# EAGLE schematic SelfTestWiring (EAGLE 7.6.0)
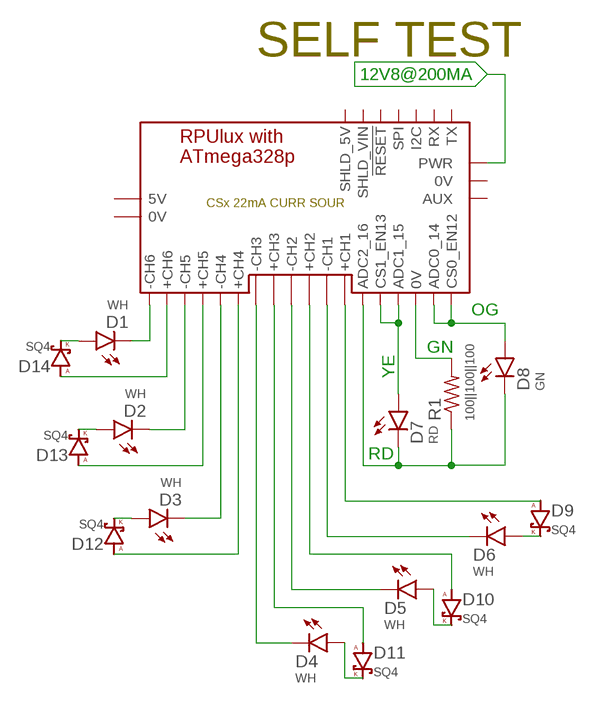
[diagram p0: schematic, sheet 1]

## Parts
D1  WH  LED5MM  [LED5MM]
D2  WH  LED5MM  [LED5MM]
D3  WH  LED5MM  [LED5MM]
D4  WH  LED5MM  [LED5MM]
D5  WH  LED5MM  [LED5MM]
D6  WH  LED5MM  [LED5MM]
D7  RD  LED5MM  [LED5MM]
D8  GN  LED5MM  [LED5MM]
D9  SQ4  DSMA  [SMA]
D10  SQ4  DSMA  [SMA]
D11  SQ4  DSMA  [SMA]
D12  SQ4  DSMA  [SMA]
D13  SQ4  DSMA  [SMA]
D14  SQ4  DSMA  [SMA]
R1  100||100||100  R0805  [C0805(2012)]
U$1  RPULUX  [WITH_RPU_NAMES]

## Nets
12V8@200MA: U$1.PWR
GN: R1.2 U$1.0V@DIO2(0V)
N$1: D1.K U$1.-CH6
N$2: D2.K U$1.-CH5
N$3: D3.K U$1.-CH4
N$4: D4.K U$1.-CH3
N$5: D5.K U$1.-CH2
N$6: D6.K U$1.-CH1
N$7: D14.A U$1.+CH6
N$8: D13.A U$1.+CH5
N$9: D12.A U$1.+CH4
N$10: D11.A U$1.+CH3
N$11: D10.A U$1.+CH2
N$12: D9.A U$1.+CH1
N$13: D6.A D9.K
N$14: D3.A D12.K
N$15: D2.A D13.K
N$16: D1.A D14.K
N$17: D5.A D10.K
N$18: D4.A D11.K
OG: D8.A U$1.22MA@ADC0(CS0_EN12) U$1.ADC0(ADC0_14)
RD: D7.K D8.K R1.1 U$1.ADC2(ADC2_16)
YE: D7.A U$1.22MA@ADC1(CS1_EN13) U$1.ADC1(ADC1_15)
Unconnected: U$1.0V U$1.0V@PWR(0V) U$1.5V U$1.!RESET U$1.AUX U$1.I2C U$1.RX U$1.SHLD_5V U$1.SHLD_VOUT(SHLD_VIN) U$1.SPI U$1.TX

## Notes on the sheet
- SELF TEST

## Library data of the parts
D1-D8 = D-LED:LED: LED 120120WH [CREE,XHGAWT-00-0000-00000HXE1] LED WHITE 6500K 150LUM-W120120
D9-D14 = D-SBR:D: DIODE
R1 = R-C:R: Resiistor American-style symbol
U$1 = Documentation:RPULUX